# EAGLE schematic 1clamp_pulse_conv (EAGLE 6.1)
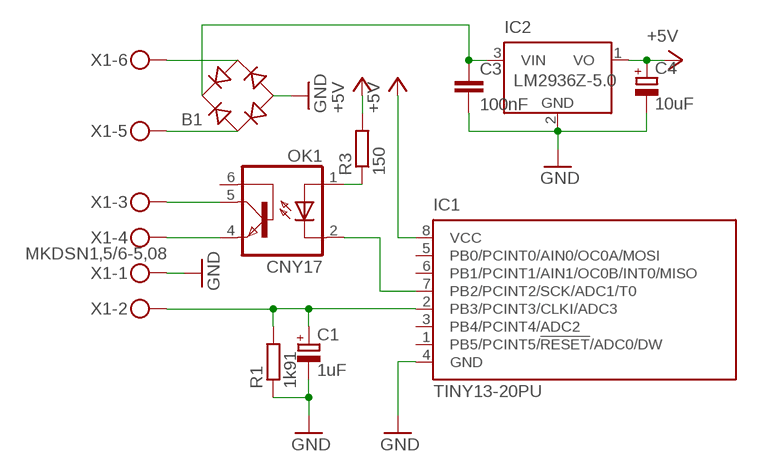
[diagram p0: schematic, sheet 1]

## Parts
B1  RB1A  [RB1A]
C1  1uF  CPOL-EUE2.5-5  [E2,5-5]
C3  100nF  C-EU025-025X050  [C025-025X050]
C4  10uF  CPOL-EUE2.5-5  [E2,5-5]
IC1  TINY13-20PU  [DIL08]
IC2  LM2936Z-5.0  [TO92]
OK1  CNY17  [DIL06]
R1  1k91  R-EU_0204/7  [0204/7]
R3  150  R-EU_0204/7  [0204/7]
X1  MKDSN1,5/6-5,08  [MKDSN1,5/6-5,08]

## Nets
+5V: C4.+ IC1.8(VCC) IC2.1(VO) R3.2
GND: B1.- C1.- C3.2 C4.- IC1.4(GND) IC2.2(GND) R1.1 X1.1
N$1: B1.+ C3.1 IC2.3(VIN)
N$2: C1.+ IC1.2(PB3/PCINT3/CLKI/ADC3) R1.2 X1.2
N$3: IC1.7(PB2/PCINT2/SCK/ADC1/T0) OK1.2(C)
N$4: OK1.1(A) R3.1
N$5: OK1.5(COL) X1.3
N$6: OK1.4(EMI) X1.4
N$7: B1.AC2 X1.6
N$8: B1.AC1 X1.5
Unconnected: IC1.1(PB5/PCINT5/!RESET!/ADC0/DW) IC1.3(PB4/PCINT4/ADC2) IC1.5(PB0/PCINT0/AIN0/OC0A/MOSI) IC1.6(PB1/PCINT1/AIN1/OC0B/INT0/MISO) OK1.6(BAS)

## Library data of the parts
B1 = rectifier:RB1A: RECTIFIER 1 A
C1 C4 = rcl:CPOL-EU: POLARIZED CAPACITOR, European symbol
C3 = rcl:C-EU: CAPACITOR, European symbol
IC1 = atmel:TINY13: 8-bit AVR Microcontroller with 1K Bytes In-System Programmable Flash Source: http://www.atmel.com/dyn/resources/prod_documents/2535S.pdf; MPN: ATTINY13-20PU; OC_FARNELL: 9171550; OC_NEWARK: 96K6521
IC2 = national-semiconductor:LM2936?*: Ultra-Low Quiescent Current LDO Voltage Regulator Source: Data sheet <http://www.national.com/ds/LM/LM2936.pdf>; MF: NATIONAL SEMICONDUCTOR; MPN: LM2936Z-5.0/NOPB; OC_FARNELL: 1150143; OC_NEWARK: 41K4533
OK1 = optocoupler:CNY17: SIEMENS OPTO COUPLER; MPN: CNY17-1; OC_FARNELL: 1045399; OC_NEWARK: 05M4044
R1 R3 = rcl:R-EU_: RESISTOR, European symbol
X1 = con-phoenix-508:MKDSN1,5/6-5,08: MKDSN 1,5/ 6-5,08 Printklemme Nennstrom: 13,5 A Nennspannung: 250 V Rastermaß: 5,08 mm Polzahl: 6 Anschlussart: Schraubanschluss Montage: Löten Anschlussrichtung Leiter/Platine: 0 ° Artikelnummer: 1729160 Source: http://eshop.phoenixcontact.com .. 1729160.pdf; MPN: SMKDSN1,5/6-5,08; OC_FARNELL: 1792907; OC_NEWARK: 70R0302